# Altium schematic sheet Bridge.SchDoc: Bridge
size A4; ApprovedBy: Maduranga Mathara Arachchi; CheckedBy: Maduranga Mathara Arachchi; Author: Maduranga Mathara Arachchi; CompanyName: Maduranga Mathara Arachchi; DrawnBy: Maduranga Mathara Arachchi; Engineer: Maduranga Mathara Arachchi; Organization: Maduranga Mathara Arachchi; Address1: 17/21, Gnanawimala Road,; Address2: Athurugiriya; Address3: Colombo,; Address4: Sri Lanka.; DocumentNumber: 1; Revision: 0.1; SheetNumber: 6; SheetTotal: 7
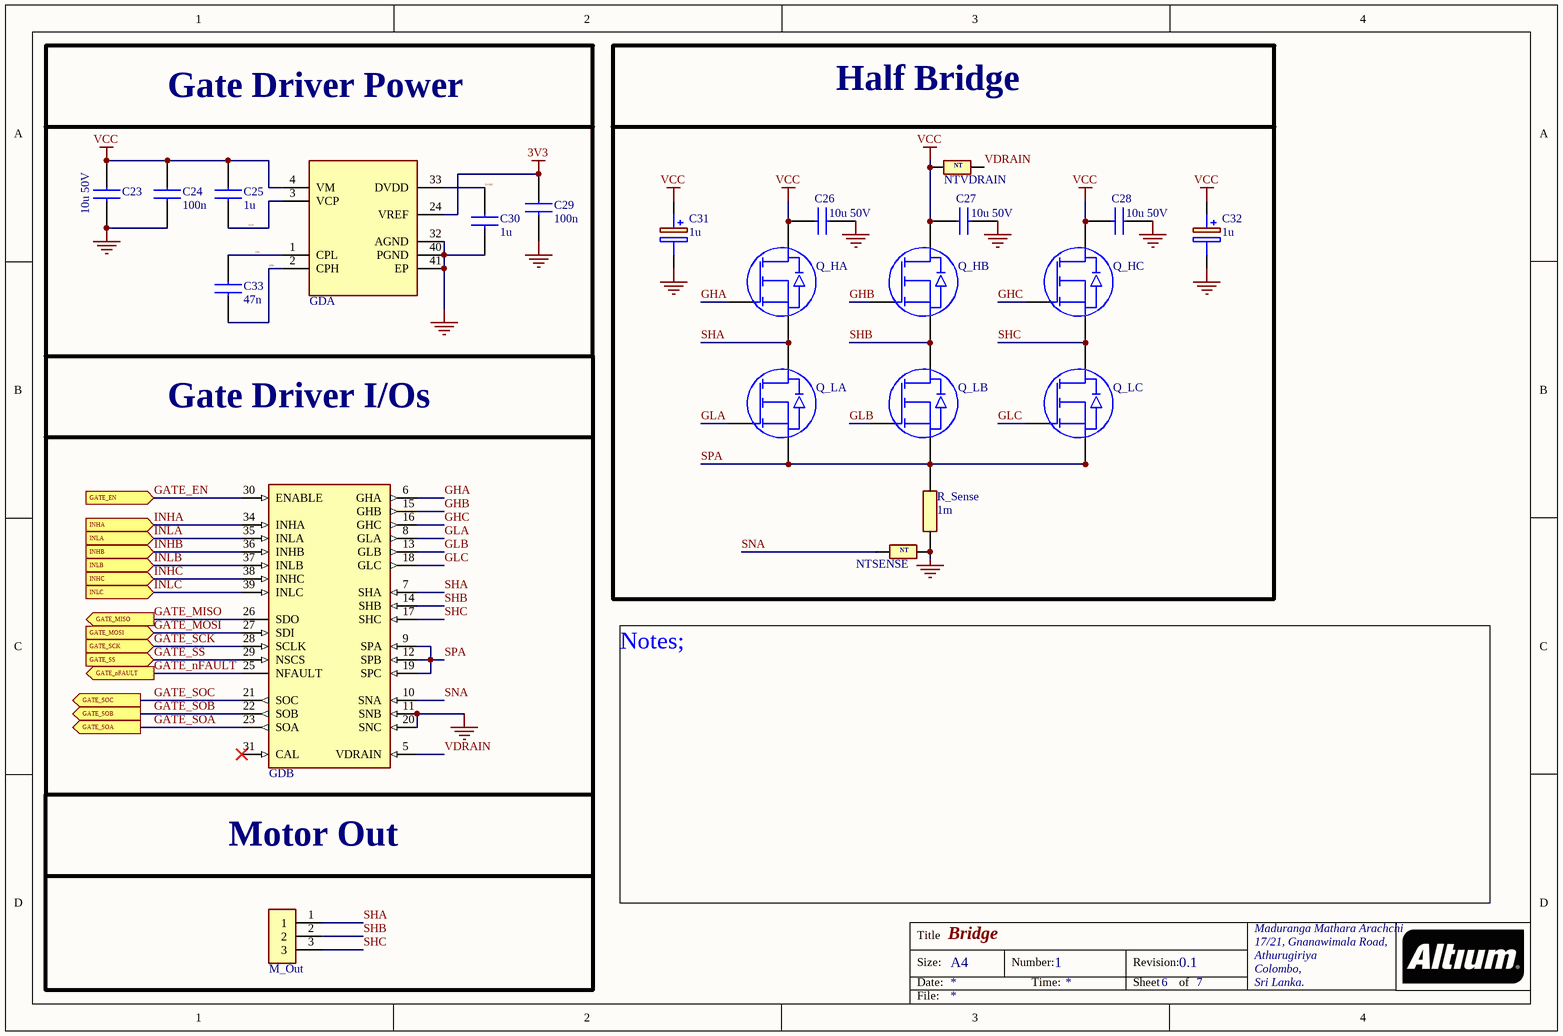
[diagram p0: Bridge.SchDoc]

## Parts
C23  10u 50V  [CAPC1608X90N]
C24  100n  [GRM18x]
C25  1u  [CAPC1608X90N]
C26  10u 50V  [CAPC1608X90N]
C27  10u 50V  [CAPC1608X90N]
C28  10u 50V  [CAPC1608X90N]
C29  100n  [GRM18x]
C30  1u  [CAPC1608X90N]
C31  1u  [CAPAE430X550N]
C32  1u  [CAPAE430X550N]
C33  47n  [CAPC1608X89N]
GD  DRV8323SRTAR  [QFN50P600X600X80-41N-D]  (value not drawn)  (parts A,B of 2)
M_Out  MR60-F.G.Y  [MR60-F.G.Y]  (value not drawn)
NTSENSE  NetTie_SMD  [NetTie_SMD]  (value not drawn)  (net tie, no BOM)
NTVDRAIN  NetTie_SMD  [NetTie_SMD]  (value not drawn)  (net tie, no BOM)
Q_HA  NTMFS5C430NT1G  [NTMFS4C022N]  (value not drawn)
Q_HB  NTMFS5C430NT1G  [NTMFS4C022N]  (value not drawn)
Q_HC  NTMFS5C430NT1G  [NTMFS4C022N]  (value not drawn)
Q_LA  NTMFS5C430NT1G  [NTMFS4C022N]  (value not drawn)
Q_LB  NTMFS5C430NT1G  [NTMFS4C022N]  (value not drawn)
Q_LC  NTMFS5C430NT1G  [NTMFS4C022N]  (value not drawn)
R_Sense  1m  [WSLF12061L000FE6]

## Blocks framed on the sheet
Gate Driver Power: C23-C25 C29 C30 C33 GD
Half Bridge: C26-C28 C31 C32 NTSENSE NTVDRAIN Q_HA Q_HB Q_HC Q_LA Q_LB Q_LC R_Sense

## Ports
GATE_EN (in), GATE_MISO (out), GATE_MOSI (in), GATE_nFAULT (out), GATE_SCK (in), GATE_SOA (out), GATE_SOB (out), GATE_SOC (out), GATE_SS (in), INHA (in), INHB (in), INHC (in), INLA (in), INLB (in), INLC (in)

## Nets
3V3: C29.2 GD.24(VREF)
GND: C23.1 C24.1 C26.2 C27.2 C28.2 C29.1 C30.1 C31.2(-) C32.2(-) GD.11(SNB) GD.20(SNC) GD.32(AGND) GD.40(PGND) GD.41(EP) NTSENSE.2 R_Sense.1
VCC: C23.2 C24.2 C25.2 C26.1 C27.1 C28.1 C31.1(+) C32.1(+) GD.4(VM) NTVDRAIN.1 Q_HA.5(D) Q_HA.6(D) Q_HA.7(D) Q_HA.8(D) Q_HA.9(D) Q_HB.5(D) Q_HB.6(D) Q_HB.7(D) Q_HB.8(D) Q_HB.9(D) Q_HC.5(D) Q_HC.6(D) Q_HC.7(D) Q_HC.8(D) Q_HC.9(D)
CPH: C33.1 GD.2(CPH)
CPL: C33.2 GD.1(CPL)
DVDD: C30.2 GD.33(DVDD)
GATE_EN: GD.30(ENABLE) ; port GATE_EN
GATE_MISO: GD.26(SDO) ; port GATE_MISO
GATE_MOSI: GD.27(SDI) ; port GATE_MOSI
GATE_nFAULT: GD.25(NFAULT) ; port GATE_nFAULT
GATE_SCK: GD.28(SCLK) ; port GATE_SCK
GATE_SOA: GD.23(SOA) ; port GATE_SOA
GATE_SOB: GD.22(SOB) ; port GATE_SOB
GATE_SOC: GD.21(SOC) ; port GATE_SOC
GATE_SS: GD.29(NSCS) ; port GATE_SS
GHA: GD.6(GHA) Q_HA.4(Gate)
GHB: GD.15(GHB) Q_HB.4(Gate)
GHC: GD.16(GHC) Q_HC.4(Gate)
GLA: GD.8(GLA) Q_LA.4(Gate)
GLB: GD.13(GLB) Q_LB.4(Gate)
GLC: GD.18(GLC) Q_LC.4(Gate)
INHA: GD.34(INHA) ; port INHA
INHB: GD.36(INHB) ; port INHB
INHC: GD.38(INHC) ; port INHC
INLA: GD.35(INLA) ; port INLA
INLB: GD.37(INLB) ; port INLB
INLC: GD.39(INLC) ; port INLC
SHA: GD.7(SHA) M_Out.1 Q_HA.1(S) Q_HA.2(S) Q_HA.3(S) Q_LA.5(D) Q_LA.6(D) Q_LA.7(D) Q_LA.8(D) Q_LA.9(D)
SHB: GD.14(SHB) M_Out.2 Q_HB.1(S) Q_HB.2(S) Q_HB.3(S) Q_LB.5(D) Q_LB.6(D) Q_LB.7(D) Q_LB.8(D) Q_LB.9(D)
SHC: GD.17(SHC) M_Out.3 Q_HC.1(S) Q_HC.2(S) Q_HC.3(S) Q_LC.5(D) Q_LC.6(D) Q_LC.7(D) Q_LC.8(D) Q_LC.9(D)
SNA: GD.10(SNA) NTSENSE.1
SPA: GD.9(SPA) GD.12(SPB) GD.19(SPC) Q_LA.1(S) Q_LA.2(S) Q_LA.3(S) Q_LB.1(S) Q_LB.2(S) Q_LB.3(S) Q_LC.1(S) Q_LC.2(S) Q_LC.3(S) R_Sense.2
VCP: C25.1 GD.3(VCP)
VDRAIN: GD.5(VDRAIN) NTVDRAIN.2

Not connected (* = marked no-connect by the designer): GD 31(CAL)*

## Notes on the sheet
- Gate Driver I/Os
- Motor Out
- Notes;
- Title
- Size:
- Date:
- A4
- Number:
- Time:
- Revision:
- Sheet
- of
- File:
- (in symbol NetTie_SMD) NT

## Library data of the parts
C23 C26-C28 = GRM188R61H225KE11D: Capacitor; Manufacturer_Name: Murata Electronics; Datasheet Link: https://search.murata.co.jp/Ceramy/image/img/A01X/G101/ENG/GRM188R61H225KE11-01A.pdf; Height: 0.9mm; Manufacturer_Part_Number: GRM188R61H225KE11D; Mouser Part Number: 81-GRM188R61H225KE1D; Mouser Price/Stock: https://www.mouser.co.uk/ProductDetail/Murata-Electronics/GRM188R61H225KE11D?qs=eeBpzGFlv%252B%2Fz%2FOAJ2DfLOw%3D%3D; Arrow Part Number: GRM188R61H225KE11D; Arrow Price/Stock: https://www.arrow.com/en/products/grm188r61h225ke11d/murata-manufacturing?utm_currency=USD&region=nac
C24 C29 = GRM188R72A104KA35D: Capacitor; Manufacturer_Name: Murata Electronics; Datasheet Link: https://search.murata.co.jp/Ceramy/image/img/A01X/G101/ENG/GRM188R72A104KA35-01A.pdf; Height: 0.9mm; Manufacturer_Part_Number: GRM188R72A104KA35D; Mouser Part Number: 81-GRM188R72A104KA35; Mouser Price/Stock: https://www.mouser.co.uk/ProductDetail/Murata-Electronics/GRM188R72A104KA35D?qs=P%252BBA3F6RM%2F5aaC9LFKRzYw%3D%3D; Arrow Part Number: GRM188R72A104KA35D; Arrow Price/Stock: https://www.arrow.com/en/products/grm188r72a104ka35d/murata-manufacturing?utm_currency=USD&region=nac
C25 C30 = MSASU168SB5105KTNA01: Capacitor; Manufacturer_Name: TAIYO YUDEN; Datasheet Link: https://ds.yuden.co.jp/TYCOMPAS/or/detail?pn=MSASU168SB5105KTNA01&u=M; Height: 0.9mm; Manufacturer_Part_Number: MSASU168SB5105KTNA01; Mouser Part Number: 963-MSASU168SB5105KT; Mouser Price/Stock: https://www.mouser.co.uk/ProductDetail/TAIYO-YUDEN/MSASU168SB5105KTNA01?qs=tlsG%2FOw5FFjgZgcWjqLW4Q%3D%3D; Arrow Part Number: MSASU168SB5105KTNA01; Arrow Price/Stock: https://www.arrow.com/en/products/msasu168sb5105ktna01/taiyo-yuden?region=nac
C31 C32 = 865081740001: Capacitor Polarised; Manufacturer_Name: Wurth Elektronik; Datasheet Link: https://www.we-online.com/components/products/datasheet/865081740001.pdf; Height: 5.5mm; Manufacturer_Part_Number: 865081740001; Mouser Part Number: 710-865081740001; Mouser Price/Stock: https://www.mouser.co.uk/ProductDetail/Wurth-Elektronik/865081740001?qs=amGC7iS6iy8gfpWwzj%2FS%2Fg%3D%3D
C33 = KAM15AR71H473KM: Capacitor; Manufacturer_Name: Kyocera AVX; Datasheet Link: https://www.mouser.com/ProductDetail/KYOCERA-AVX/KAM15AR71H473KM?qs=Jm2GQyTW%2Fbirhk%2FTN5CLyw%3D%3D; Height: 0.89mm; Manufacturer_Part_Number: KAM15AR71H473KM; Mouser Part Number: 581-KAM15AR71H473KM; Mouser Price/Stock: https://www.mouser.co.uk/ProductDetail/KYOCERA-AVX/KAM15AR71H473KM?qs=Jm2GQyTW%2Fbirhk%2FTN5CLyw%3D%3D; Arrow Part Number: KAM15AR71H473KM; Arrow Price/Stock: https://www.arrow.com/en/products/kam15ar71h473km/avx?region=nac
GD = DRV8323SRTAR: Integrated Circuit; Manufacturer_Name: Texas Instruments; Datasheet Link: http://www.ti.com/lit/ds/symlink/drv8323.pdf; Height: 0.8mm; Manufacturer_Part_Number: DRV8323SRTAR; Mouser Part Number: 595-DRV8323SRTAR; Mouser Price/Stock: https://www.mouser.co.uk/ProductDetail/Texas-Instruments/DRV8323SRTAR?qs=u4fy%2FsgLU9P2gpPTX6mffg%3D%3D; Arrow Part Number: DRV8323SRTAR; Arrow Price/Stock: https://www.arrow.com/en/products/drv8323srtar/texas-instruments?utm_currency=USD&region=nac
M_Out = MR60-F.G.Y: High Current Pluggable Cables Assemblies ROHS
Q_HA Q_HB Q_HC Q_LA Q_LB Q_LC = NTMFS5C430NT1G: MOSFET (N-Channel); Manufacturer_Name: onsemi; Datasheet Link: https://www.onsemi.com/pub/Collateral/NTMFS4C03N-D.PDF; Height: 1.1mm; Manufacturer_Part_Number: NTMFS5C430NT1G; Mouser Part Number: 863-NTMFS5C430NT1G; Mouser Price/Stock: https://www.mouser.co.uk/ProductDetail/ON-Semiconductor/NTMFS5C430NT1G?qs=OycAS1CGnliPpFX2vF53nQ%3D%3D; Arrow Part Number: NTMFS5C430NT1G; Arrow Price/Stock: https://www.arrow.com/en/products/ntmfs5c430nt1g/on-semiconductor
R_Sense = WSLF12061L000FE6: Resistor; Manufacturer_Name: Vishay; Datasheet Link: https://www.mouser.com/ProductDetail/Vishay-Dale/WSLF12061L000FE6?qs=ZcfC38r4PovQE2MJp0mYbA%3D%3D&srsltid=AfmBOorChnK_yDo1m4XS1OcwHom5geXYRBAQAQW72Pk4TppObIeOkLu6; Height: 1mm; Manufacturer_Part_Number: WSLF12061L000FE6; Mouser Part Number: 71-WSLF12061L000FE6; Mouser Price/Stock: https://www.mouser.co.uk/ProductDetail/Vishay-Dale/WSLF12061L000FE6?qs=ZcfC38r4PovQE2MJp0mYbA%3D%3D